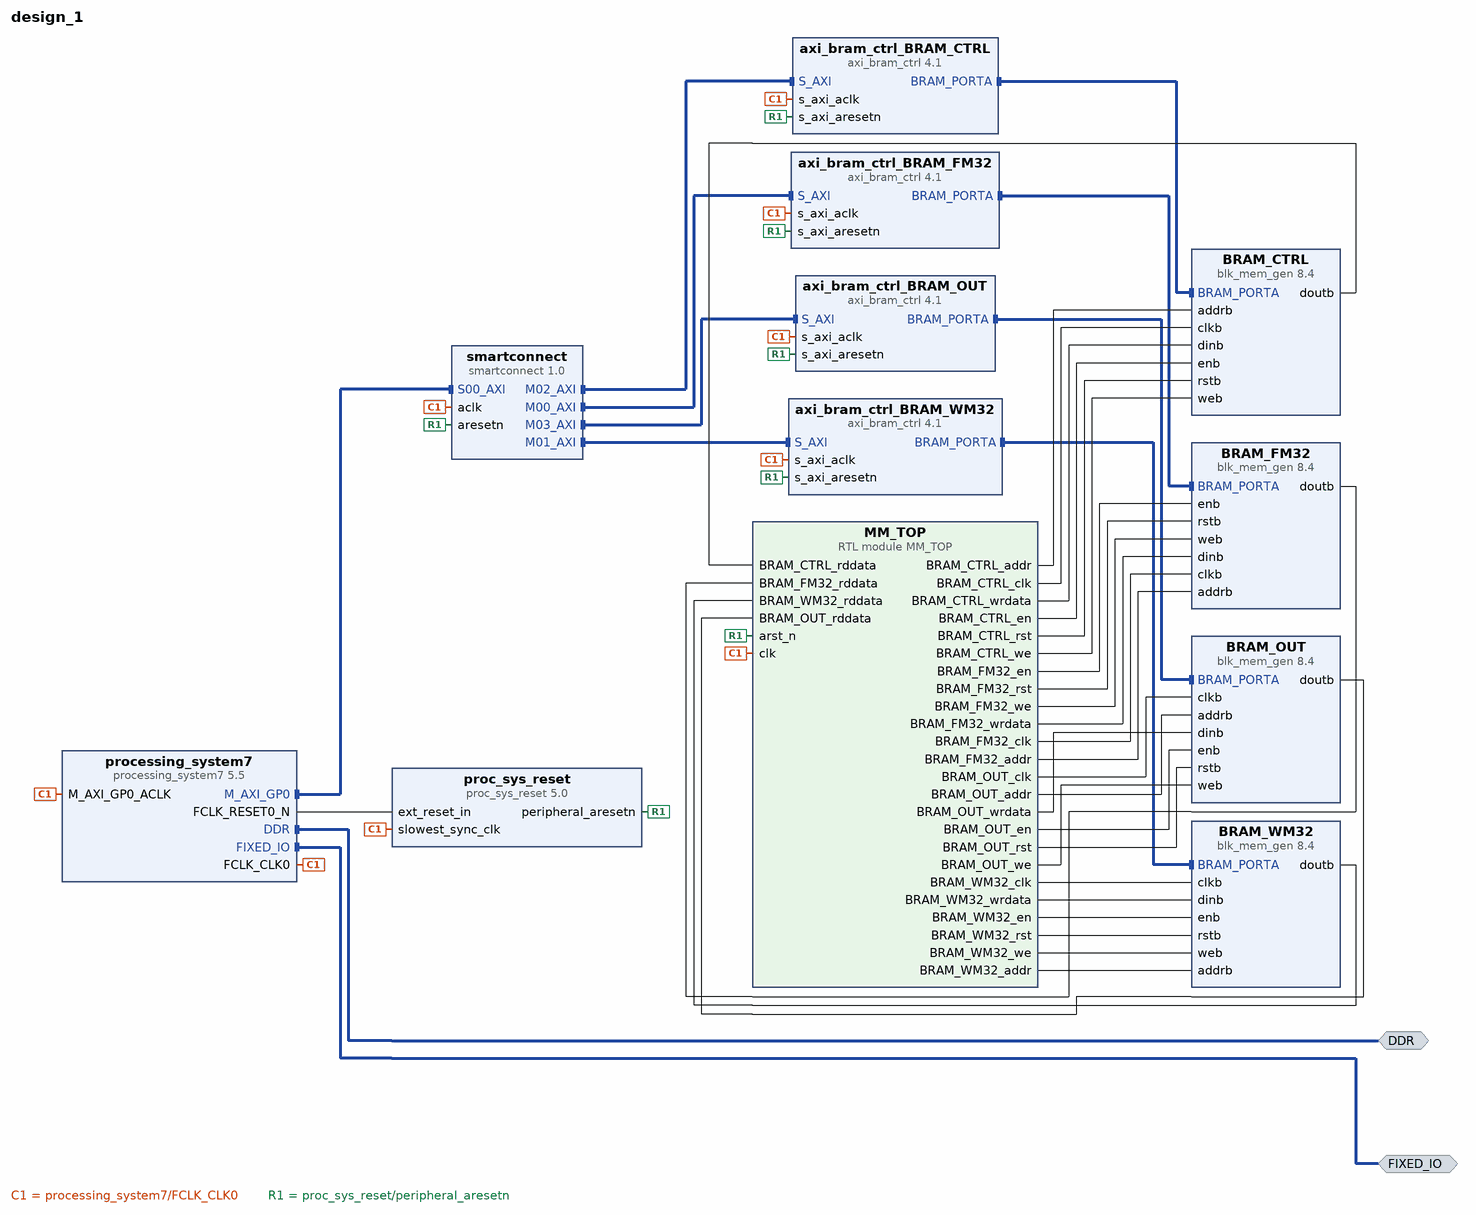
[diagram p0: block diagram of the top level]
# Vivado block design design_1, xc7z020clg400-2, Vivado 2019.2
create_bd_design design_1

create_bd_intf_port -mode Master -vlnv xilinx.com:interface:ddrx_rtl:1.0 DDR
create_bd_intf_port -mode Master -vlnv xilinx.com:display_processing_system7:fixedio_rtl:1.0 FIXED_IO

create_bd_cell -type ip -vlnv xilinx.com:ip:processing_system7:5.5 processing_system7
set_property -dict [list \
  CONFIG.PCW_ENET0_ENET0_IO {MIO 16 .. 27} \
  CONFIG.PCW_ENET0_GRP_MDIO_ENABLE 1 \
  CONFIG.PCW_ENET0_GRP_MDIO_IO {MIO 52 .. 53} \
  CONFIG.PCW_ENET0_PERIPHERAL_ENABLE 1 \
  CONFIG.PCW_ENET0_RESET_ENABLE 1 \
  CONFIG.PCW_ENET0_RESET_IO {MIO 7} \
  CONFIG.PCW_ENET_RESET_ENABLE 1 \
  CONFIG.PCW_ENET_RESET_SELECT {Share reset pin} \
  CONFIG.PCW_FPGA0_PERIPHERAL_FREQMHZ 125 \
  CONFIG.PCW_GPIO_MIO_GPIO_ENABLE 1 \
  CONFIG.PCW_GPIO_MIO_GPIO_IO MIO \
  CONFIG.PCW_I2C_RESET_ENABLE 1 \
  CONFIG.PCW_PRESET_BANK1_VOLTAGE {LVCMOS 1.8V} \
  CONFIG.PCW_QSPI_GRP_SINGLE_SS_ENABLE 1 \
  CONFIG.PCW_QSPI_GRP_SINGLE_SS_IO {MIO 1 .. 6} \
  CONFIG.PCW_QSPI_PERIPHERAL_ENABLE 1 \
  CONFIG.PCW_QSPI_QSPI_IO {MIO 1 .. 6} \
  CONFIG.PCW_SD0_GRP_CD_ENABLE 1 \
  CONFIG.PCW_SD0_GRP_CD_IO {MIO 10} \
  CONFIG.PCW_SD0_GRP_WP_ENABLE 0 \
  CONFIG.PCW_SD0_PERIPHERAL_ENABLE 1 \
  CONFIG.PCW_SD0_SD0_IO {MIO 40 .. 45} \
  CONFIG.PCW_SD1_PERIPHERAL_ENABLE 1 \
  CONFIG.PCW_SD1_SD1_IO {MIO 46 .. 51} \
  CONFIG.PCW_SDIO_PERIPHERAL_FREQMHZ 100 \
  CONFIG.PCW_SINGLE_QSPI_DATA_MODE x4 \
  CONFIG.PCW_UART1_PERIPHERAL_ENABLE 1 \
  CONFIG.PCW_UART1_UART1_IO {MIO 12 .. 13} \
  CONFIG.PCW_UART_PERIPHERAL_FREQMHZ 100 \
  CONFIG.PCW_UIPARAM_DDR_PARTNO {MT41J256M16 RE-125} \
  CONFIG.PCW_USB0_PERIPHERAL_ENABLE 1 \
  CONFIG.PCW_USB0_RESET_ENABLE 1 \
  CONFIG.PCW_USB0_RESET_IO {MIO 8} \
  CONFIG.PCW_USB0_USB0_IO {MIO 28 .. 39} \
  CONFIG.PCW_USB_RESET_ENABLE 1 \
  CONFIG.PCW_USB_RESET_SELECT {Share reset pin} \
] [get_bd_cells processing_system7]
# 211 more settings of processing_system7 are not shown: defaults, MIO pin electricals, DDR timing, and values the tool derives
create_bd_cell -type ip -vlnv xilinx.com:ip:proc_sys_reset:5.0 proc_sys_reset
create_bd_cell -type ip -vlnv xilinx.com:ip:smartconnect:1.0 smartconnect
set_property -dict {CONFIG.NUM_MI 4 CONFIG.NUM_SI 1} [get_bd_cells smartconnect]
create_bd_cell -type ip -vlnv xilinx.com:ip:axi_bram_ctrl:4.1 axi_bram_ctrl_BRAM_FM32
set_property -dict {CONFIG.PROTOCOL AXI4LITE CONFIG.SINGLE_PORT_BRAM 1} [get_bd_cells axi_bram_ctrl_BRAM_FM32]
create_bd_cell -type ip -vlnv xilinx.com:ip:axi_bram_ctrl:4.1 axi_bram_ctrl_BRAM_WM32
set_property -dict {CONFIG.PROTOCOL AXI4LITE CONFIG.SINGLE_PORT_BRAM 1} [get_bd_cells axi_bram_ctrl_BRAM_WM32]
create_bd_cell -type ip -vlnv xilinx.com:ip:axi_bram_ctrl:4.1 axi_bram_ctrl_BRAM_CTRL
set_property -dict {CONFIG.PROTOCOL AXI4LITE CONFIG.SINGLE_PORT_BRAM 1} [get_bd_cells axi_bram_ctrl_BRAM_CTRL]
create_bd_cell -type ip -vlnv xilinx.com:ip:axi_bram_ctrl:4.1 axi_bram_ctrl_BRAM_OUT
set_property -dict {CONFIG.PROTOCOL AXI4LITE CONFIG.SINGLE_PORT_BRAM 1} [get_bd_cells axi_bram_ctrl_BRAM_OUT]
create_bd_cell -type ip -vlnv xilinx.com:ip:blk_mem_gen:8.4 BRAM_FM32
set_property -dict {CONFIG.EN_SAFETY_CKT false CONFIG.Memory_Type True_Dual_Port_RAM} [get_bd_cells BRAM_FM32]
create_bd_cell -type ip -vlnv xilinx.com:ip:blk_mem_gen:8.4 BRAM_WM32
set_property -dict {CONFIG.EN_SAFETY_CKT false CONFIG.Memory_Type True_Dual_Port_RAM} [get_bd_cells BRAM_WM32]
create_bd_cell -type ip -vlnv xilinx.com:ip:blk_mem_gen:8.4 BRAM_CTRL
set_property -dict {CONFIG.EN_SAFETY_CKT false CONFIG.Memory_Type True_Dual_Port_RAM} [get_bd_cells BRAM_CTRL]
create_bd_cell -type ip -vlnv xilinx.com:ip:blk_mem_gen:8.4 BRAM_OUT
set_property -dict {CONFIG.EN_SAFETY_CKT false CONFIG.Memory_Type True_Dual_Port_RAM} [get_bd_cells BRAM_OUT]
create_bd_cell -type module -reference MM_TOP MM_TOP

# ---- connections ----

connect_bd_intf_net -intf_net processing_system7_0_DDR [get_bd_intf_ports DDR] [get_bd_intf_pins processing_system7/DDR]
connect_bd_intf_net -intf_net processing_system7_0_FIXED_IO [get_bd_intf_ports FIXED_IO] [get_bd_intf_pins processing_system7/FIXED_IO]
connect_bd_intf_net -intf_net axi_bram_ctrl_1_BRAM_PORTA [get_bd_intf_pins BRAM_WM32/BRAM_PORTA] [get_bd_intf_pins axi_bram_ctrl_BRAM_WM32/BRAM_PORTA]
connect_bd_intf_net -intf_net axi_bram_ctrl_3_BRAM_PORTA [get_bd_intf_pins BRAM_OUT/BRAM_PORTA] [get_bd_intf_pins axi_bram_ctrl_BRAM_OUT/BRAM_PORTA]
connect_bd_intf_net -intf_net smartconnect_0_M00_AXI [get_bd_intf_pins smartconnect/M00_AXI] [get_bd_intf_pins axi_bram_ctrl_BRAM_FM32/S_AXI]
connect_bd_intf_net -intf_net processing_system7_0_M_AXI_GP0 [get_bd_intf_pins processing_system7/M_AXI_GP0] [get_bd_intf_pins smartconnect/S00_AXI]
connect_bd_intf_net [get_bd_intf_pins smartconnect/M02_AXI] [get_bd_intf_pins axi_bram_ctrl_BRAM_CTRL/S_AXI]
connect_bd_intf_net -intf_net axi_bram_ctrl_2_BRAM_PORTA [get_bd_intf_pins BRAM_CTRL/BRAM_PORTA] [get_bd_intf_pins axi_bram_ctrl_BRAM_CTRL/BRAM_PORTA]
connect_bd_intf_net -intf_net smartconnect_0_M01_AXI [get_bd_intf_pins smartconnect/M01_AXI] [get_bd_intf_pins axi_bram_ctrl_BRAM_WM32/S_AXI]
connect_bd_intf_net [get_bd_intf_pins smartconnect/M03_AXI] [get_bd_intf_pins axi_bram_ctrl_BRAM_OUT/S_AXI]
connect_bd_intf_net -intf_net axi_bram_ctrl_0_BRAM_PORTA [get_bd_intf_pins BRAM_FM32/BRAM_PORTA] [get_bd_intf_pins axi_bram_ctrl_BRAM_FM32/BRAM_PORTA]
connect_bd_net -net processing_system7_0_FCLK_RESET0_N [get_bd_pins processing_system7/FCLK_RESET0_N] [get_bd_pins proc_sys_reset/ext_reset_in]
connect_bd_net -net processing_system7_0_FCLK_CLK0 [get_bd_pins processing_system7/FCLK_CLK0] \
  [get_bd_pins smartconnect/aclk] [get_bd_pins proc_sys_reset/slowest_sync_clk] \
  [get_bd_pins processing_system7/M_AXI_GP0_ACLK] [get_bd_pins axi_bram_ctrl_BRAM_FM32/s_axi_aclk] \
  [get_bd_pins axi_bram_ctrl_BRAM_WM32/s_axi_aclk] [get_bd_pins axi_bram_ctrl_BRAM_CTRL/s_axi_aclk] \
  [get_bd_pins axi_bram_ctrl_BRAM_OUT/s_axi_aclk] [get_bd_pins MM_TOP/clk]
connect_bd_net -net vio_0_probe_out0 [get_bd_pins proc_sys_reset/peripheral_aresetn] \
  [get_bd_pins smartconnect/aresetn] [get_bd_pins axi_bram_ctrl_BRAM_FM32/s_axi_aresetn] \
  [get_bd_pins axi_bram_ctrl_BRAM_WM32/s_axi_aresetn] [get_bd_pins axi_bram_ctrl_BRAM_CTRL/s_axi_aresetn] \
  [get_bd_pins axi_bram_ctrl_BRAM_OUT/s_axi_aresetn] [get_bd_pins MM_TOP/arst_n]
connect_bd_net [get_bd_pins MM_TOP/BRAM_FM32_en] [get_bd_pins BRAM_FM32/enb]
connect_bd_net [get_bd_pins MM_TOP/BRAM_FM32_rst] [get_bd_pins BRAM_FM32/rstb]
connect_bd_net [get_bd_pins MM_TOP/BRAM_FM32_we] [get_bd_pins BRAM_FM32/web]
connect_bd_net [get_bd_pins MM_TOP/BRAM_FM32_wrdata] [get_bd_pins BRAM_FM32/dinb]
connect_bd_net [get_bd_pins MM_TOP/BRAM_FM32_clk] [get_bd_pins BRAM_FM32/clkb]
connect_bd_net [get_bd_pins MM_TOP/BRAM_FM32_addr] [get_bd_pins BRAM_FM32/addrb]
connect_bd_net [get_bd_pins BRAM_FM32/doutb] [get_bd_pins MM_TOP/BRAM_FM32_rddata]
connect_bd_net [get_bd_pins MM_TOP/BRAM_WM32_clk] [get_bd_pins BRAM_WM32/clkb]
connect_bd_net [get_bd_pins MM_TOP/BRAM_WM32_wrdata] [get_bd_pins BRAM_WM32/dinb]
connect_bd_net [get_bd_pins MM_TOP/BRAM_WM32_en] [get_bd_pins BRAM_WM32/enb]
connect_bd_net [get_bd_pins MM_TOP/BRAM_WM32_rst] [get_bd_pins BRAM_WM32/rstb]
connect_bd_net [get_bd_pins MM_TOP/BRAM_WM32_we] [get_bd_pins BRAM_WM32/web]
connect_bd_net [get_bd_pins MM_TOP/BRAM_WM32_addr] [get_bd_pins BRAM_WM32/addrb]
connect_bd_net [get_bd_pins BRAM_WM32/doutb] [get_bd_pins MM_TOP/BRAM_WM32_rddata]
connect_bd_net [get_bd_pins MM_TOP/BRAM_OUT_clk] [get_bd_pins BRAM_OUT/clkb]
connect_bd_net [get_bd_pins MM_TOP/BRAM_OUT_addr] [get_bd_pins BRAM_OUT/addrb]
connect_bd_net [get_bd_pins MM_TOP/BRAM_OUT_wrdata] [get_bd_pins BRAM_OUT/dinb]
connect_bd_net [get_bd_pins MM_TOP/BRAM_OUT_en] [get_bd_pins BRAM_OUT/enb]
connect_bd_net [get_bd_pins MM_TOP/BRAM_OUT_rst] [get_bd_pins BRAM_OUT/rstb]
connect_bd_net [get_bd_pins MM_TOP/BRAM_OUT_we] [get_bd_pins BRAM_OUT/web]
connect_bd_net [get_bd_pins BRAM_OUT/doutb] [get_bd_pins MM_TOP/BRAM_OUT_rddata]
connect_bd_net [get_bd_pins MM_TOP/BRAM_CTRL_addr] [get_bd_pins BRAM_CTRL/addrb]
connect_bd_net [get_bd_pins MM_TOP/BRAM_CTRL_clk] [get_bd_pins BRAM_CTRL/clkb]
connect_bd_net [get_bd_pins MM_TOP/BRAM_CTRL_wrdata] [get_bd_pins BRAM_CTRL/dinb]
connect_bd_net [get_bd_pins BRAM_CTRL/doutb] [get_bd_pins MM_TOP/BRAM_CTRL_rddata]
connect_bd_net [get_bd_pins MM_TOP/BRAM_CTRL_en] [get_bd_pins BRAM_CTRL/enb]
connect_bd_net [get_bd_pins MM_TOP/BRAM_CTRL_rst] [get_bd_pins BRAM_CTRL/rstb]
connect_bd_net [get_bd_pins MM_TOP/BRAM_CTRL_we] [get_bd_pins BRAM_CTRL/web]
set_property HDL_ATTRIBUTE.BMM_INFO_PROCESSOR {arm > design_1 axi_bram_ctrl_BRAM_FM32 design_1 axi_bram_ctrl_BRAM_WM32 design_1 axi_bram_ctrl_BRAM_OUT design_1 axi_bram_ctrl_BRAM_CTRL} [get_bd_cells processing_system7]
set_property HDL_ATTRIBUTE.KEEP_HIERARCHY yes [get_bd_cells processing_system7]
set_property HDL_ATTRIBUTE.BMM_INFO_ADDRESS_SPACE {byte  0x40000000 32 > design_1 BRAM_FM32} [get_bd_cells axi_bram_ctrl_BRAM_FM32]
set_property HDL_ATTRIBUTE.KEEP_HIERARCHY yes [get_bd_cells axi_bram_ctrl_BRAM_FM32]
set_property HDL_ATTRIBUTE.BMM_INFO_ADDRESS_SPACE {byte  0x40020000 32 > design_1 BRAM_WM32} [get_bd_cells axi_bram_ctrl_BRAM_WM32]
set_property HDL_ATTRIBUTE.KEEP_HIERARCHY yes [get_bd_cells axi_bram_ctrl_BRAM_WM32]
set_property HDL_ATTRIBUTE.BMM_INFO_ADDRESS_SPACE {byte  0x40060000 32 > design_1 BRAM_CTRL} [get_bd_cells axi_bram_ctrl_BRAM_CTRL]
set_property HDL_ATTRIBUTE.KEEP_HIERARCHY yes [get_bd_cells axi_bram_ctrl_BRAM_CTRL]
set_property HDL_ATTRIBUTE.BMM_INFO_ADDRESS_SPACE {byte  0x40040000 32 > design_1 BRAM_OUT} [get_bd_cells axi_bram_ctrl_BRAM_OUT]
set_property HDL_ATTRIBUTE.KEEP_HIERARCHY yes [get_bd_cells axi_bram_ctrl_BRAM_OUT]

# ---- address map ----
assign_bd_address -offset 0x40000000 -range 32K -target_address_space [get_bd_addr_spaces processing_system7/Data] [get_bd_addr_segs axi_bram_ctrl_BRAM_FM32/S_AXI/Mem0]
assign_bd_address -offset 0x40020000 -range 128K -target_address_space [get_bd_addr_spaces processing_system7/Data] [get_bd_addr_segs axi_bram_ctrl_BRAM_WM32/S_AXI/Mem0]
assign_bd_address -offset 0x40040000 -range 32K -target_address_space [get_bd_addr_spaces processing_system7/Data] [get_bd_addr_segs axi_bram_ctrl_BRAM_OUT/S_AXI/Mem0]
assign_bd_address -offset 0x40060000 -range 4K -target_address_space [get_bd_addr_spaces processing_system7/Data] [get_bd_addr_segs axi_bram_ctrl_BRAM_CTRL/S_AXI/Mem0]

validate_bd_design
save_bd_design
